# EasyEDA Pro project 平移_立创EDA.epro

# Schematic Schematic1
Board Name: Board1; Create Date: 2025-01-22; Page Name: P1; Project Name: 磁悬浮原理图; Schematic Name: Schematic1; Update Date: 2025-01-25; Company: 嘉立创EDA; Page Size: A4; Version: V1.0
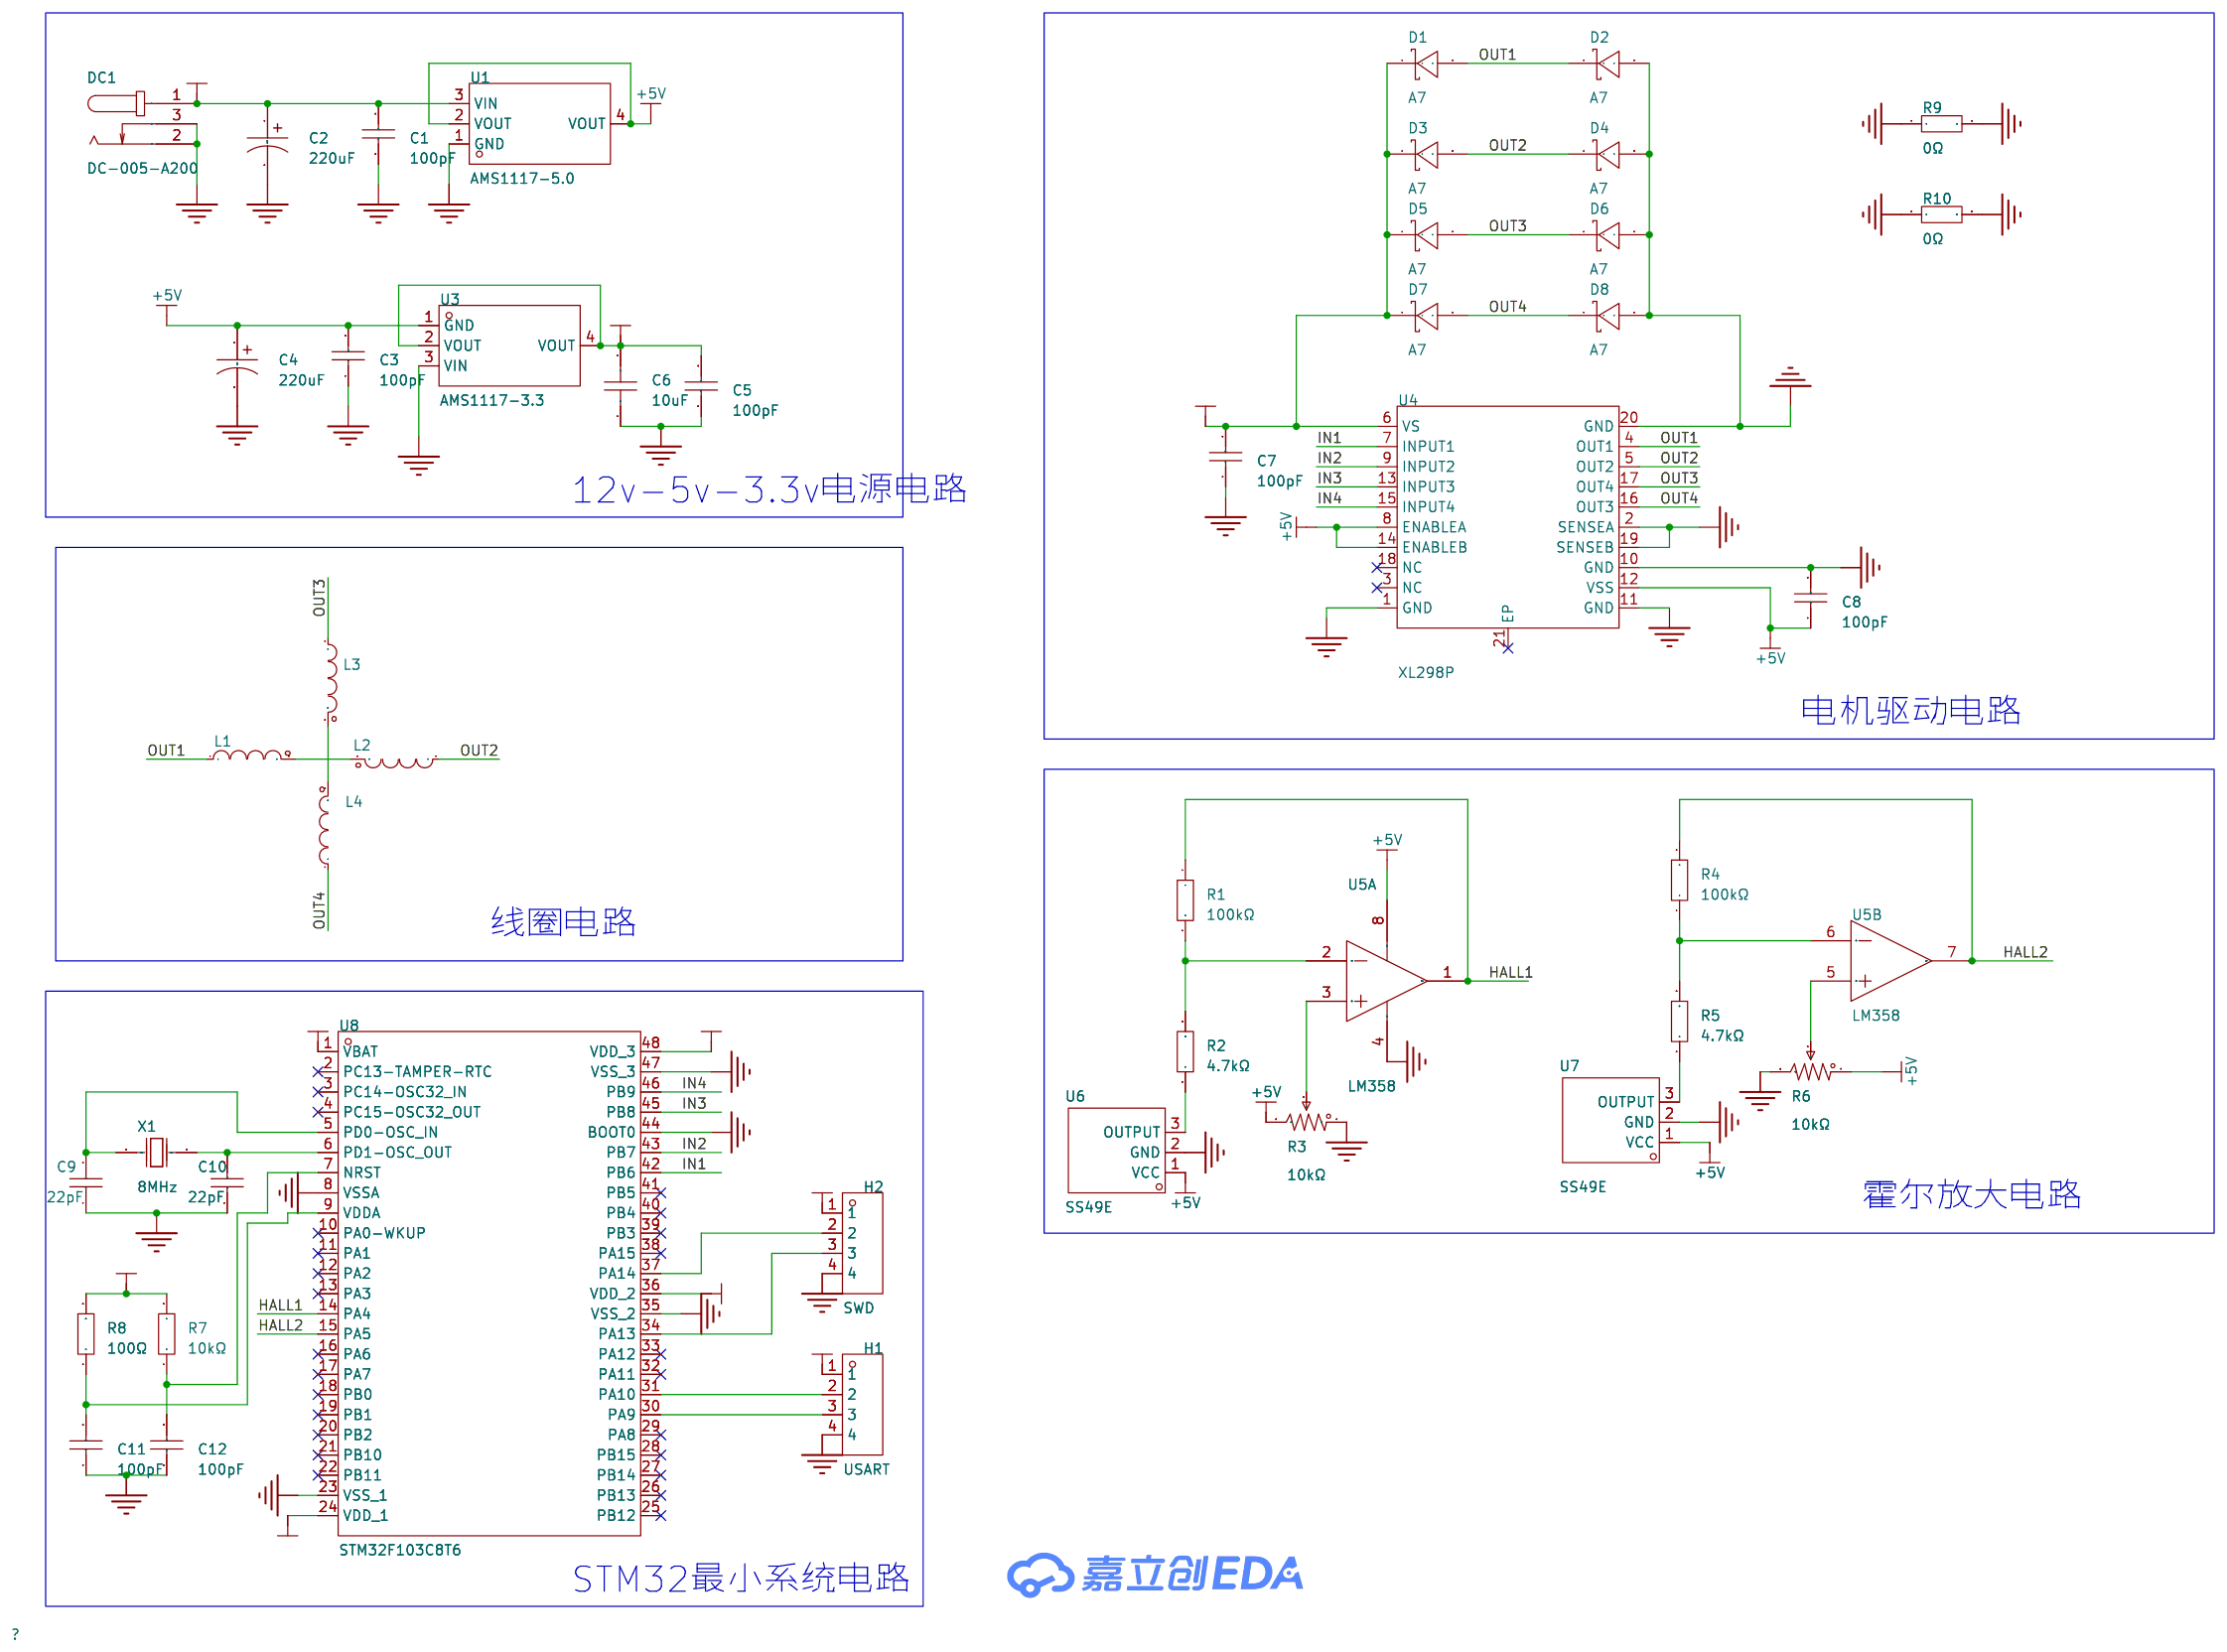
[diagram p0: schematic sheet]

## Parts
C1  100pF  [C0805]
C2  220uF  [CAP-SMD_BD10.0-L10.3-W10.3-LS11.3-FD]
C3  100pF  [C0805]
C4  220uF  [CAP-SMD_BD10.0-L10.3-W10.3-LS11.3-FD]
C5  100pF  [C0805]
C6  10uF  [C0805]
C7  100pF  [C0805]
C8  100pF  [C0805]
C9  22pF  [C0805]
C10  22pF  [C0805]
C11  100pF  [C0805]
C12  100pF  [C0805]
D1  A7  [SOD-123FL_L2.8-W1.8-LS3.7-RD]
D2  A7  [SOD-123FL_L2.8-W1.8-LS3.7-RD]
D3  A7  [SOD-123FL_L2.8-W1.8-LS3.7-RD]
D4  A7  [SOD-123FL_L2.8-W1.8-LS3.7-RD]
D5  A7  [SOD-123FL_L2.8-W1.8-LS3.7-RD]
D6  A7  [SOD-123FL_L2.8-W1.8-LS3.7-RD]
D7  A7  [SOD-123FL_L2.8-W1.8-LS3.7-RD]
D8  A7  [SOD-123FL_L2.8-W1.8-LS3.7-RD]
DC1  DC-005-A200  [DC-IN-TH_DC-005-A200]
H1  USART  [HDR-TH_4P-P2.54-V-M]
H2  SWD  [HDR-TH_4P-P2.54-V-M]
L1  -  [L_INVERTER2_2.1]
L2  -  [L_INVERTER2_2.1]
L3  -  [L_INVERTER2_2.1]
L4  -  [L_INVERTER2_2.1]
R1  100kΩ  [R0805]
R2  4.7kΩ  [R0805]
R3  10kΩ  [RES-ADJ-TH_3P-L10.0-W10.0-P2.50-L]
R4  100kΩ  [R0805]
R5  4.7kΩ  [R0805]
R6  10kΩ  [RES-ADJ-TH_3P-L10.0-W10.0-P2.50-L]
R7  10kΩ  [R0805]
R8  100Ω  [R0805]
R9  0Ω  [R0805]
R10  0Ω  [R0805]
U1  AMS1117-5.0  [SOT-223_L6.5-W3.5-P2.30-LS7.0-BR]
U3  AMS1117-3.3  [SOT-223-3_L6.5-W3.4-P2.30-LS7.0-BR]
U4  XL298P  [HSOP-20_L15.9-W11.0-P1.27-LS14.2-BL-EP]
U5  LM358  [SOP-8_L4.9-W3.9-P1.27-LS6.0-BL]  (sections 1,2)
U6  SS49E  [TO-92S_3P-L4.1-W1.6-P1.27-L]
U7  SS49E  [TO-92S_3P-L4.1-W1.6-P1.27-L]
U8  STM32F103C8T6  [LQFP-48_L7.0-W7.0-P0.50-LS9.0-BL]
X1  8MHz  [CRYSTAL-SMD_L11.5-W4.8-LS12.7]

## Library data of the parts
C1 C3 C5 C7 C8 C11 C12 = CL21C101JBANNNC: 容值:100pF;精度:±5%;额定电压:50V;材质(温度系数):C0G;; LCSC Part Name: 100pF ±5% 50V; Supplier Part: C1790; Manufacturer: SAMSUNG(三星); Supplier Footprint: 0805; JLCPCB Part Class: 基础库; Datasheet: https://atta.szlcsc.com/upload/public/pdf/source/20160218/1457707763339.pdf; Supplier: LCSC; Tolerance: ±5%; Voltage Rated: 50V; Temperature Coefficient: C0G
C2 C4 = HV1H227M1010PZ: 容值:220uF;精度:±20%;额定电压:50V;; LCSC Part Name: 220uF ±20% 50V; Supplier Part: C5246564; Manufacturer: HONOR(荣誉); Supplier Footprint: SMD,D10xL10mm; JLCPCB Part Class: 扩展库; Datasheet: https://atta.szlcsc.com/upload/public/pdf/source/20221103/F889AFCC379E96C645A0A58E4BAC43B0.pdf; Supplier: LCSC; Tolerance: ±20%; Rated Voltage: 50V; φD: 10mm; L: 10mm; Operating Temperature: -55℃~+105℃
C6 = GRM21BR61H106KE43L: 容值:10uF;精度:±10%;额定电压:50V;材质(温度系数):X5R;; LCSC Part Name: 10uF ±10% 50V; Supplier Part: C440198; Manufacturer: muRata(村田); Supplier Footprint: 0805; JLCPCB Part Class: 基础库; Datasheet: https://atta.szlcsc.com/upload/public/pdf/source/20230811/95AAE0C9AF55EDC31B7A4D8B733F534E.pdf; Supplier: LCSC; Tolerance: ±10%; Voltage Rated: 50V; Temperature Coefficient: X5R
C9 C10 = CL21C220JBANNNC: 容值:22pF;精度:±5%;额定电压:50V;材质(温度系数):C0G;; LCSC Part Name: 22pF ±5% 50V; Supplier Part: C1804; Manufacturer: SAMSUNG(三星); Supplier Footprint: 0805; JLCPCB Part Class: 基础库; Datasheet: https://atta.szlcsc.com/upload/public/pdf/source/20160218/1457707763339.pdf; Supplier: LCSC; Tolerance: ±5%; Voltage Rated: 50V; Temperature Coefficient: C0G
D1-D8 = A7_C2891324: 二极管配置:独立式;正向压降(Vf):1.1V@1A;直流反向耐压(Vr):1kV;整流电流:1A;; Supplier Part: C2891324; Manufacturer: GOODWORK(固得沃克); Supplier Footprint: SOD-123FL; JLCPCB Part Class: 扩展库; Datasheet: https://atta.szlcsc.com/upload/public/pdf/source/20240805/B2ACAE0AA1526C78641CB14B0F7BAE8A.pdf; Supplier: LCSC; Diode Configuration: 独立式; Forward Voltage (Vf@If): 1.1V@1A; Reverse Voltage (Vr): 1kV; Rectified Current: 1A; Reverse Leakage Current (Ir): 5uA@1kV
DC1 = DC-005-A200: 连接器类型:DC电源插座;安装方式:弯插;触点内径:2mm;触点外径:6.4mm;额定电流:3A;额定电压:30V;工作温度范围:-20℃~+70℃;; LCSC Part Name: DC电源插座 内径:2mm 外径:6.4mm; Supplier Part: C720557; Manufacturer: XUNPU(讯普); Supplier Footprint: 插件; JLCPCB Part Class: 扩展库; Datasheet: https://atta.szlcsc.com/upload/public/pdf/source/20200812/C720557_2286DFCD6C75B71AF905731F627ABF3A.pdf; Supplier: LCSC; Connector Type: DC电源插座; Mounting Style: 弯插; Inside Contact Diameter: 2mm; Outside Contact Diameter: 6.4mm; Current Rating (Max): 3A; Voltage Rating (Max): 30V; Operating Temperature Range: -20℃~+70℃
H1 H2 = PZ254V-11-04P: 插针结构:1x4P;间距:2.54mm;行距:-;圆针/方针:方针;安装类型:直插;排数:单排;总PIN位数:4P;额定电流:3A;额定电压:250V;配合针长度:6mm;塑高:2.5mm;端接针长度:3mm;触头材质:-;工作温度范围:-40℃~+105℃;颜色:黑色;; LCSC Part Name: 间距:2.54mm 1x4P 直插 方针; Supplier Part: C2691448; Manufacturer: XFCN(兴飞); Supplier Footprint: 插件,P=2.54mm; JLCPCB Part Class: 扩展库; Datasheet: https://atta.szlcsc.com/upload/public/pdf/source/20200309/C492403_F9F19131791D08044AD4F84F8E751A34.pdf; Supplier: LCSC; Pin Structure: 1x4P; Pitch: 2.54mm; Circluar Pins/Square Pins: 方针; Mounting Type: 直插; Number of Rows: 单排; Number of Pins: 4P; Current Rating (Max): 3A; Voltage Rating (Max): 250V; Length of Mating Pin: 6mm; Insulation Height: 2.5mm; Length of End Connection Pin: 3mm; Operating Temperature Range: -40℃~+105℃; Color: 黑色
L1-L4 = L-6Ω-3.54
R1 R4 = 0805W8F1003T5E: 电阻类型:厚膜电阻;阻值:100kΩ;精度:±1%;功率:125mW;最大工作电压:150V;温度系数:±100ppm/℃;; LCSC Part Name: 100kΩ ±1% 125mW 厚膜电阻; Supplier Part: C149504; Manufacturer: UNI-ROYAL(厚声); Supplier Footprint: 0805; JLCPCB Part Class: 基础库; Datasheet: https://atta.szlcsc.com/upload/public/pdf/source/20200306/C422600_1E6D84923E4A46A82E41ADD87F860B5C.pdf; Supplier: LCSC; Type: 厚膜电阻; Tolerance: ±1%; Power(Watts): 125mW; Overload Voltage (Max): 150V; Temperature Coefficient: ±100ppm/℃; Operating Temperature Range: -55℃~+155℃
R2 R5 = 0805W8F4701T5E: 电阻类型:厚膜电阻;阻值:4.7kΩ;精度:±1%;功率:125mW;最大工作电压:150V;温度系数:±100ppm/℃;; LCSC Part Name: 4.7kΩ ±1% 125mW 厚膜电阻; Supplier Part: C17673; Manufacturer: UNI-ROYAL(厚声); Supplier Footprint: 0805; JLCPCB Part Class: 基础库; Datasheet: https://atta.szlcsc.com/upload/public/pdf/source/20200306/C422600_1E6D84923E4A46A82E41ADD87F860B5C.pdf; Supplier: LCSC; Type: 厚膜电阻; Tolerance: ±1%; Power(Watts): 125mW; Overload Voltage (Max): 150V; Temperature Coefficient: ±100ppm/℃; Operating Temperature Range: -55℃~+155℃
R3 R6 = 3296W-1-103: 阻值:10kΩ;精度:±10%;; LCSC Part Name: 10kΩ ±10%; Supplier Part: C118954; Manufacturer: BOCHEN(博晨); Supplier Footprint: 插件; JLCPCB Part Class: 扩展库; Datasheet: https://atta.szlcsc.com/upload/public/pdf/source/20171114/C118954_15106326646611117443.pdf; Supplier: LCSC; Tolerance: ±10%
R7 = 0805W8F1002T5E_C17414: 电阻类型:厚膜电阻;阻值:10kΩ;精度:±1%;功率:125mW;最大工作电压:150V;温度系数:±100ppm/℃;; LCSC Part Name: 10kΩ ±1% 125mW 厚膜电阻; Supplier Part: C17414; Manufacturer: UNI-ROYAL(厚声); Manufacturer Part: 0805W8F1002T5E; Supplier Footprint: 0805; JLCPCB Part Class: 基础库; Datasheet: https://atta.szlcsc.com/upload/public/pdf/source/20200306/C422600_1E6D84923E4A46A82E41ADD87F860B5C.pdf; Supplier: LCSC; Type: 厚膜电阻; Tolerance: ±1%; Power(Watts): 125mW; Overload Voltage (Max): 150V; Temperature Coefficient: ±100ppm/℃; Operating Temperature Range: -55℃~+155℃
R8 = 0805W8F1000T5E: 电阻类型:厚膜电阻;阻值:100Ω;精度:±1%;功率:125mW;最大工作电压:150V;温度系数:±100ppm/℃;; LCSC Part Name: 100Ω ±1% 125mW 厚膜电阻; Supplier Part: C17408; Manufacturer: UNI-ROYAL(厚声); Supplier Footprint: 0805; JLCPCB Part Class: 基础库; Datasheet: https://atta.szlcsc.com/upload/public/pdf/source/20200306/C422600_1E6D84923E4A46A82E41ADD87F860B5C.pdf; Supplier: LCSC; Type: 厚膜电阻; Tolerance: ±1%; Power(Watts): 125mW; Overload Voltage (Max): 150V; Temperature Coefficient: ±100ppm/℃; Operating Temperature Range: -55℃~+155℃
R9 R10 = 0805W8F0000T5E: 电阻类型:厚膜电阻;阻值:0Ω;精度:±1%;功率:125mW;最大工作电压:150V;温度系数:±800ppm/℃;; LCSC Part Name: 0Ω ±1% 125mW 厚膜电阻; Supplier Part: C17477; Manufacturer: UNI-ROYAL(厚声); Supplier Footprint: 0805; JLCPCB Part Class: 基础库; Datasheet: https://atta.szlcsc.com/upload/public/pdf/source/20200306/C422600_1E6D84923E4A46A82E41ADD87F860B5C.pdf; Supplier: LCSC; Type: 厚膜电阻; Tolerance: ±1%; Power(Watts): 125mW; Overload Voltage (Max): 150V; Temperature Coefficient: ±800ppm/℃; Operating Temperature Range: -55℃~+155℃
U1 = AMS1117-5.0_C6187: 输出类型:固定;最大输入电压:12V;输出电压:5V;最大输出电流:1A;电源纹波抑制比(PSRR):68dB@(120Hz);输出极性:正极;; LCSC Part Name: 输入12V 输出5V 1A; Supplier Part: C6187; Manufacturer: AMS; Supplier Footprint: SOT-223; JLCPCB Part Class: 基础库; Datasheet: https://atta.szlcsc.com/upload/public/pdf/source/20230918/E4B716057EE82179D88E8A0894830D59.pdf; Supplier: LCSC; Output Type: 固定; Maximum Input Voltage: 12V; Output Voltage: 5V; MAX Output Current: 1A; Power Supply Rejection Ratio (PSRR): 68dB@(120Hz); Dropout Voltage: 1.3V@(1A); Output Polarity: 正极; Number of Outputs: 1
U3 = AMS1117-3.3_C6186: 输出类型:固定;最大输入电压:-;输出电压:3.3V;最大输出电流:1A;电源纹波抑制比(PSRR):72dB@(120Hz);输出极性:正极;; LCSC Part Name: 输出3.3V 1A; Supplier Part: C6186; Manufacturer: AMS; Supplier Footprint: SOT-223; JLCPCB Part Class: 基础库; Datasheet: https://atta.szlcsc.com/upload/public/pdf/source/20180727/C6186_7A095716F0823C02F1997A905E26C086.pdf; Supplier: LCSC; Output Type: 固定; Output Voltage: 3.3V; MAX Output Current: 1A; Power Supply Rejection Ratio (PSRR): 72dB@(120Hz); Dropout Voltage: 1.3V@(800mA); Output Polarity: 正极; Number of Outputs: 1
U4 = XL298P: Supplier Part: C17179540; Manufacturer: XINLUDA(信路达); Supplier Footprint: HSOP-20; JLCPCB Part Class: 扩展库; Datasheet: https://atta.szlcsc.com/upload/public/pdf/source/20230817/4EF804C328D573B64EB8B0D65C14F3E5.pdf; Supplier: LCSC
U5 = LM358_C5252902: 放大器数:双路;增益带宽积(GBP):1.2MHz;输入偏置电流(Ib):50nA;输入失调电压(Vos):5mV;; LCSC Part Name: 增益带宽(GBP):1.2MHz VIO:5mV  LM358; Supplier Part: C5252902; Manufacturer: MSKSEMI(美森科); Supplier Footprint: SOP-8; JLCPCB Part Class: 扩展库; Datasheet: https://atta.szlcsc.com/upload/public/pdf/source/20221111/EFA130B3B4599AE68A453AC9B85C4BC9.pdf; Supplier: LCSC; Number of Circuits: 双路; Gain Bandwidth Product(GBP): 1.2MHz; Current - Input Bias(Ib): 50nA; Voltage - Input Offset(Vos): 5mV; Common Mode Rejection Ratio (CMRR): 80dB; Supply Voltage: 3V~36V; Output Type: 差分; Supply Current: 300uA; Operating Temperature: 0℃~+70℃
U6 U7 = SS49E: 线性霍尔效应传感器; LCSC Part Name: 霍尔效应传感器; Supplier Part: C85697; Manufacturer: Honeywell(霍尼韦尔); Supplier Footprint: TO-92S; JLCPCB Part Class: 扩展库; Datasheet: https://atta.szlcsc.com/upload/public/pdf/source/20210618/C85697_E65AF15A662ABF64EA11C392420B5C9E.pdf; Supplier: LCSC; supply voltage: 2.7V~6.5V; Operating Temperature: -40℃~+85℃
U8 = STM32F103C8T6: CPU内核:ARM-M3;CPU最大主频:72MHz;应用领域:-;; LCSC Part Name: 主流增强型ARM Cortex-M3 MCU，具有64 KB Flash、72 MHz CPU、电机控制、USB和CAN; Supplier Part: C8734; Manufacturer: ST(意法半导体); Supplier Footprint: LQFP-48(7x7); JLCPCB Part Class: 扩展库; Datasheet: https://atta.szlcsc.com/upload/public/pdf/source/20220812/8363ACEC51AD55ECEB84799464F7CB85.pdf; Supplier: LCSC; CPU Core: ARM-M3; CPU Maximum Speed: 72MHz; Program Storage Size: 64KB; Program Memory Type: FLASH; Number of I/O: 37; ADC (Bit): 12bit; Low Voltage Detection Threshold: 2V~3.6V
X1 = X49SM8MSD2SC: 晶振类型:贴片晶振;频率:8MHz;常温频差:±20ppm;外接负载电容:20pF;频率稳定度(全温):±30ppm;; LCSC Part Name: 8MHz ±20ppm 20pF; Supplier Part: C12674; Manufacturer: YXC(扬兴晶振); Supplier Footprint: HC-49S-SMD; JLCPCB Part Class: 基础库; Datasheet: https://atta.szlcsc.com/upload/public/pdf/source/20240329/3EBF42EBCAB50CA65B6FA9D7CFA1955A.pdf; Supplier: LCSC; Crystal Type: 贴片晶振; Normal temperature Frequency Tolerance: ±20ppm; External load capacitor: 20pF; Frequency Stability(Full temperature range): ±30ppm; Operating Temperature: -20℃~+70℃

## Nets
+3.3V: C5.2 C6.2 H1.1 H2.1 R7.2 R8.2 U3.2(VOUT) U3.4(VOUT) U8.1(VBAT) U8.24(VDD_1) U8.36(VDD_2) U8.48(VDD_3)
+5V: C3.2 C4.1 C8.1 R3.3 R6.1 U1.2(VOUT) U1.4(VOUT) U3.1(GND) U4.8(ENABLEA) U4.12(VSS) U4.14(ENABLEB) U5.8(VCC) U6.1(VCC) U7.1(VCC)
+12V: C1.2 C2.1 C7.2 D1.1(K) D3.1(K) D5.1(K) D7.1(K) DC1.1 U1.3(VIN) U4.6(VS)
AGND: C3.1 C4.2 R3.1 R6.3 R10.1 U1.1(GND) U5.4(VEE) U6.2(GND) U7.2(GND)
GND: C5.1 C6.1 C9.1 C10.1 C11.1 C12.1 H1.4 H2.4 R9.2 R10.2 U3.3(VIN) U8.8(VSSA) U8.23(VSS_1) U8.35(VSS_2) U8.44(BOOT0) U8.47(VSS_3)
PGND: C1.1 C2.2 C7.1 C8.2 D2.2(A) D4.2(A) D6.2(A) D8.2(A) DC1.2 DC1.3 R9.1 U4.1(GND) U4.2(SENSEA) U4.10(GND) U4.11(GND) U4.19(SENSEB) U4.20(GND)
HALL1: R1.1 U5.1(OUT1) U8.14(PA4)
HALL2: R4.2 U5.7(OUT2) U8.15(PA5)
IN1: U4.7(INPUT1) U8.42(PB6)
IN2: U4.9(INPUT2) U8.43(PB7)
IN3: U4.13(INPUT3) U8.45(PB8)
IN4: U4.15(INPUT4) U8.46(PB9)
OUT1: D1.2(A) D2.1(K) L1.1 U4.4(OUT1)
OUT2: D3.2(A) D4.1(K) L2.1 U4.5(OUT2)
OUT3: D5.2(A) D6.1(K) L3.1 U4.17(OUT4)
OUT4: D7.2(A) D8.1(K) L4.1 U4.16(OUT3)
$1N1272: L1.2 L2.2
$1N1276: L3.2 L4.2
$1N2639: R1.2 R2.2 U5.2(IN1-)
$1N2854: R3.2 U5.3(IN1+)
$1N2963: R2.1 U6.3(OUTPUT)
$1N3239: R4.1 R5.2 U5.6(IN2-)
$1N3245: R5.1 U7.3(OUTPUT)
$1N3247: R6.2 U5.5(IN2+)
$1N3876: C10.2 U8.6(PD1-OSC_OUT) X1.1(OSC1)
$1N3912: C9.2 U8.5(PD0-OSC_IN) X1.2(OSC2)
$1N4191: C11.2 R8.1 U8.9(VDDA)
$1N4193: C12.2 R7.1 U8.7(NRST)
Net-(H1-2): H1.2 U8.31(PA10)
Net-(H1-3): H1.3 U8.30(PA9)
Net-(H2-2): H2.2 U8.37(PA14)
Net-(H2-3): H2.3 U8.34(PA13)

Not connected (* = marked no-connect by the designer): U4 3(NC)* 18(NC)* 21(EP)*; U8 2(PC13-TAMPER-RTC)* 3(PC14-OSC32_IN)* 4(PC15-OSC32_OUT)* 10(PA0-WKUP)* 11(PA1)* 12(PA2)* 13(PA3)* 16(PA6)* 17(PA7)* 18(PB0)* 19(PB1)* 20(PB2)* 21(PB10)* 22(PB11)* 25(PB12)* 26(PB13)* 27(PB14)* 28(PB15)* 29(PA8)* 32(PA11)* 33(PA12)* 38(PA15)* 39(PB3)* 40(PB4)* 41(PB5)*

## Notes on the sheet
- 12v-5v-3.3v电源电路
- 电机驱动电路
- 线圈电路
- 霍尔放大电路
- STM32最小系统电路

# Board PCB1
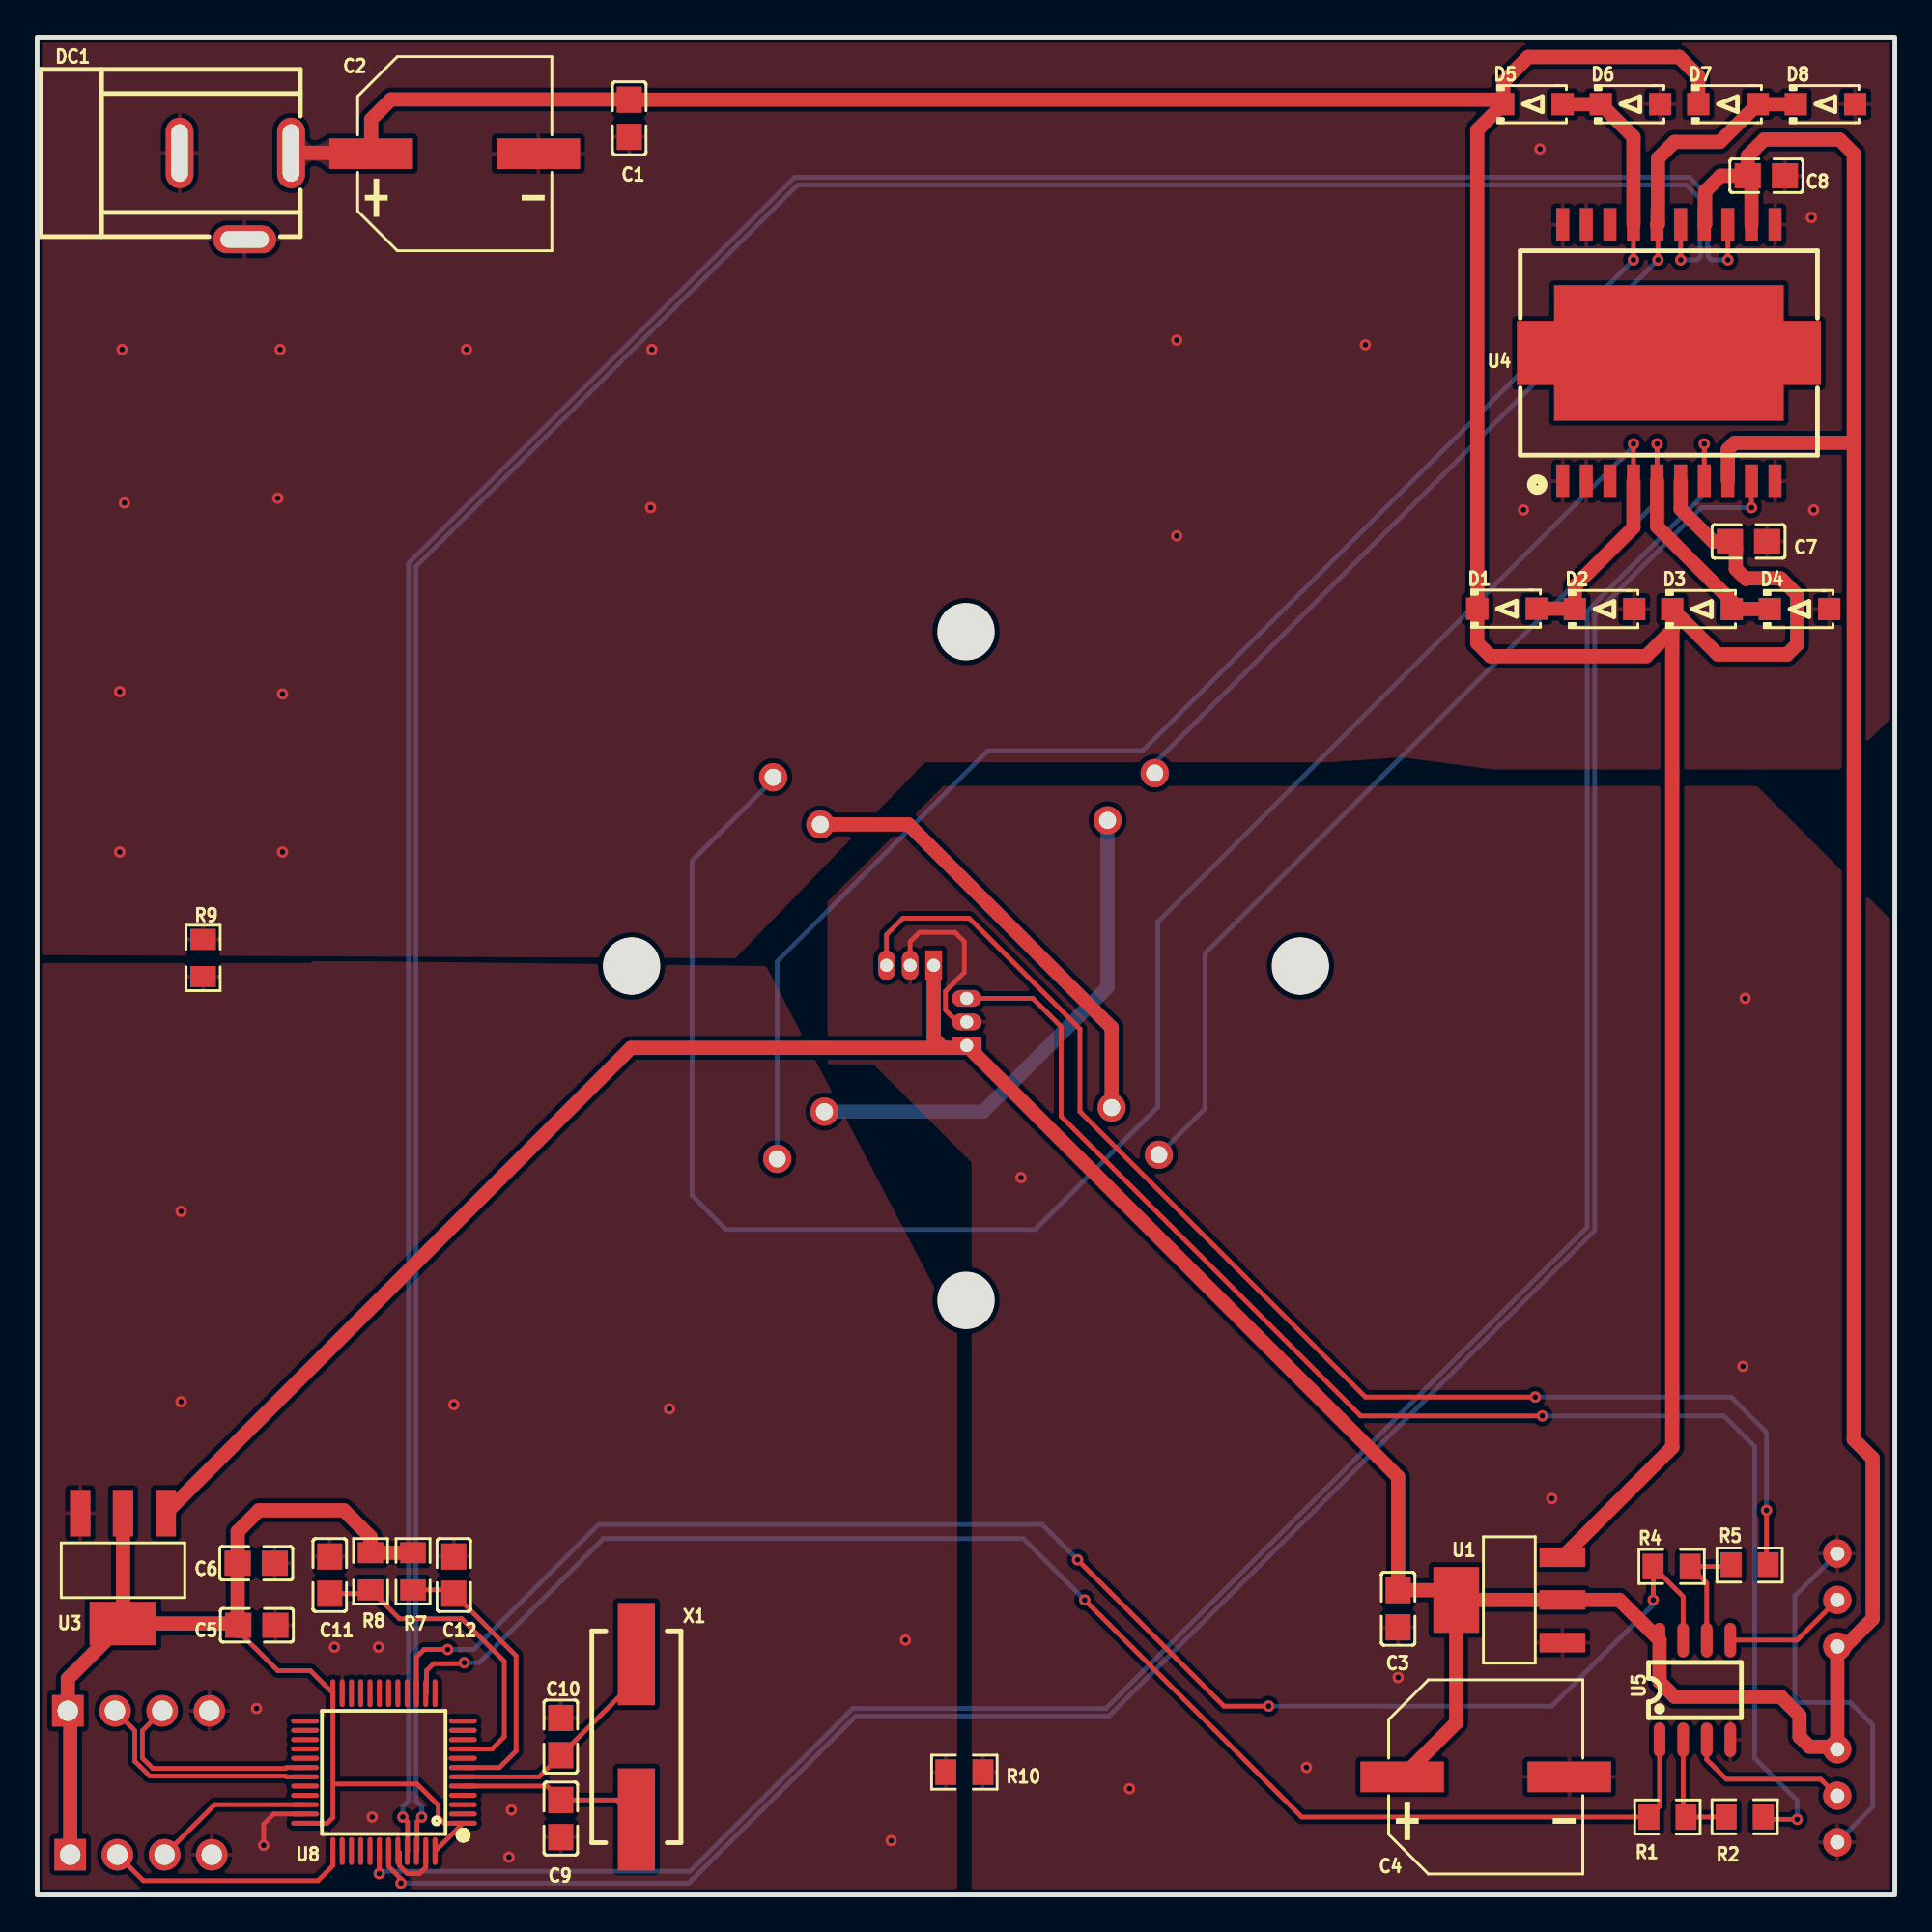
[diagram p1: board, top side]
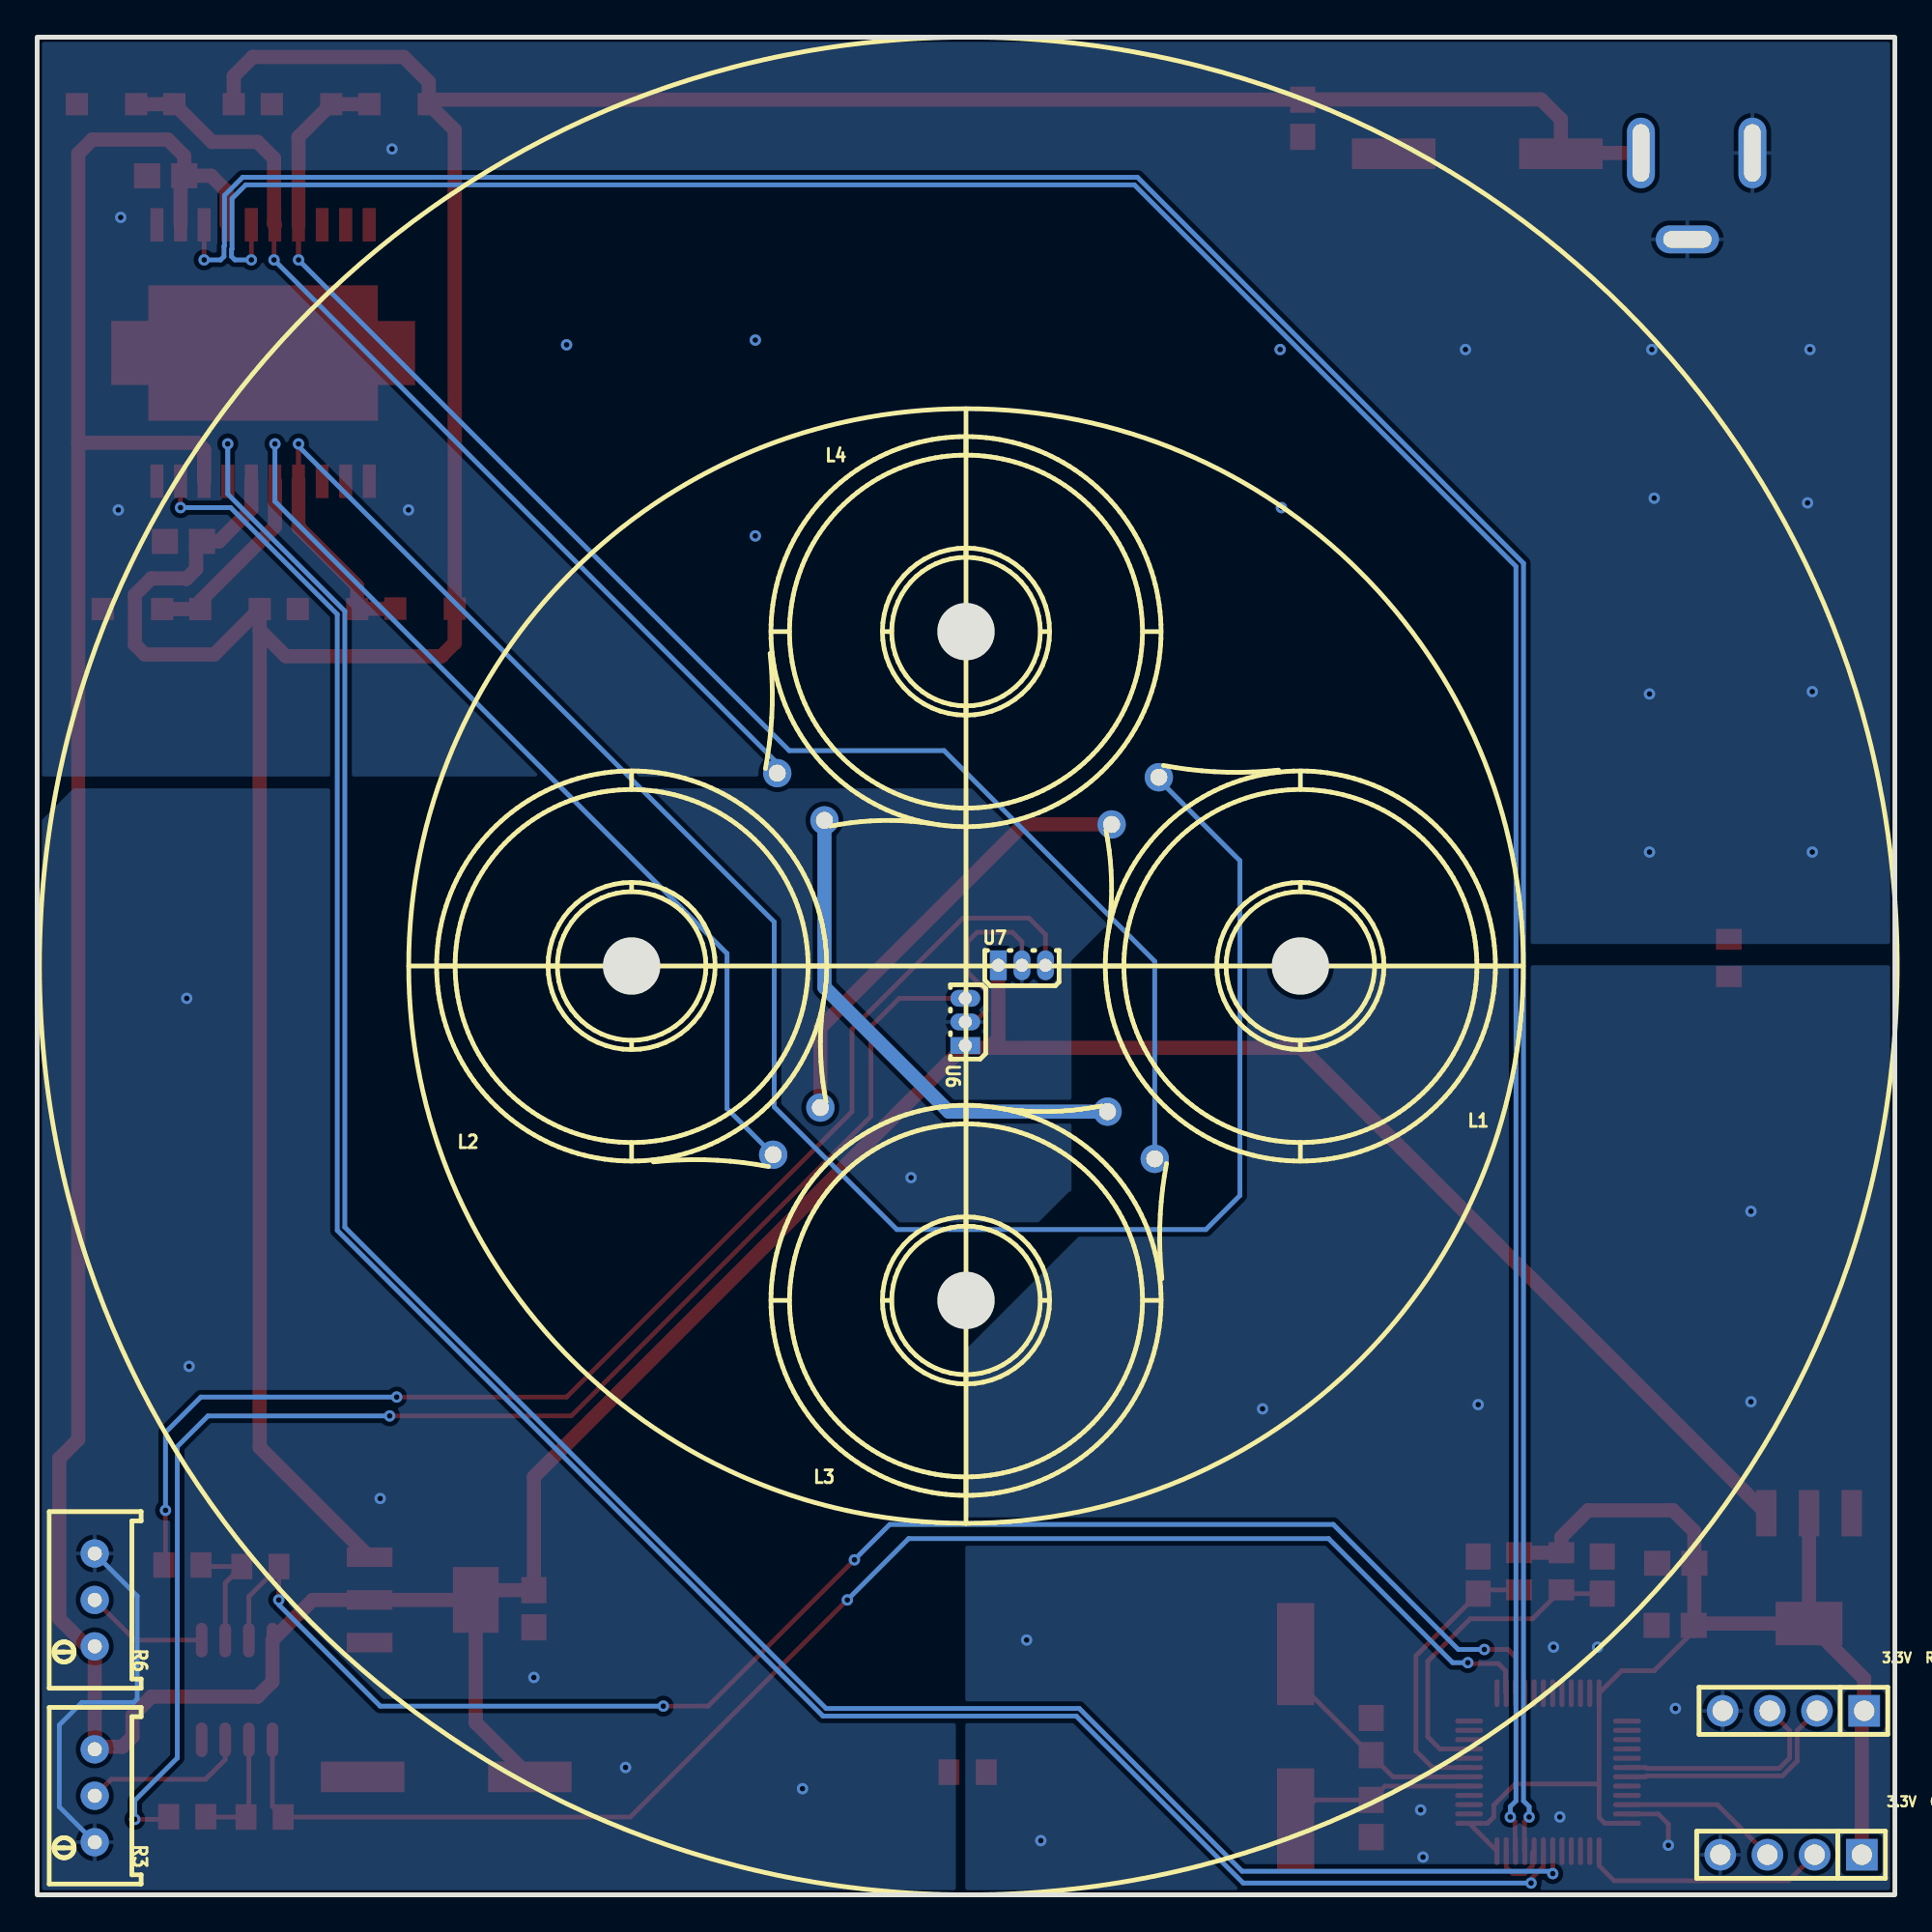
[diagram p2: board, bottom side, seen from below]

Outline 100 x 100 mm; copper layers: Top Layer, Bottom Layer. Coordinates in mm from the lower left corner of the outline.
Outline path: rectangle 0,0 100,100
Stack: Top Layer 0.035mm / Dielectric1 1.51mm FR4 er 4.5 / Bottom Layer 0.035mm

## Design rules (mm)
net $1N4555: DP1
net $1N4551: DP1
net IN1: DP2
net IN2: DP2
net IN3: DP3
net IN4: DP3
template: JLCPCB Capability(Two Layers Board)
spacing copperThickness1oz (default): track to track 0.102, other pairs 0.152 to 0.3
spacing copperThickness2oz: track to track 0.203, other pairs 0.152 to 0.3
track width copperThickness1oz (default): min 0.127, default 0.254, max 2.54
track width copperThickness2oz: min 0.203, default 0.254, max 2.54
differential pair differentialPair (default): width min 0.127, default 0.254, max 2.54; gap min 0.152, default 0.152
via viaSize (default): diameter min 0.5, default 0.61, max 10; hole min 0.3, default 0.305, max 6.3

## Placement (name value [footprint] x y rotation side)
3.3V  CLK  DIO  GND  -  [HDR-TH_4P-P2.54-V-M]  5.59 2.16 0 bottom
3.3V  RX  TX  GND  -  [HDR-TH_4P-P2.54-V-M]  5.46 9.91 0 bottom
C1  100pF  [C0805]  31.88 95.64 90 top
C2  220uF  [CAP-SMD_BD10.0-L10.3-W10.3-LS11.3-FD]  22.48 93.73 0 top
C3  100pF  [C0805]  73.26 15.4 90 top
C4  220uF  [CAP-SMD_BD10.0-L10.3-W10.3-LS11.3-FD]  77.98 6.35 0 top
C5  100pF  [C0805]  11.83 14.51 180 top
C6  10uF  [C0805]  11.79 17.85 180 top
C7  100pF  [C0805]  92.12 72.86 180 top
C8  100pF  [C0805]  93.08 92.54 0 top
C9  22pF  [C0805]  28.19 4.11 90 top
C10  22pF  [C0805]  28.19 8.52 270 top
C11  100pF  [C0805]  15.75 17.21 270 top
C12  100pF  [C0805]  22.43 17.21 270 top
D1  A7  [SOD-123FL_L2.8-W1.8-LS3.7-RD]  79.12 69.23 0 top
D2  A7  [SOD-123FL_L2.8-W1.8-LS3.7-RD]  84.37 69.22 0 top
D3  A7  [SOD-123FL_L2.8-W1.8-LS3.7-RD]  89.62 69.22 0 top
D4  A7  [SOD-123FL_L2.8-W1.8-LS3.7-RD]  94.87 69.22 0 top
D5  A7  [SOD-123FL_L2.8-W1.8-LS3.7-RD]  80.52 96.39 0 top
D6  A7  [SOD-123FL_L2.8-W1.8-LS3.7-RD]  85.77 96.39 0 top
D7  A7  [SOD-123FL_L2.8-W1.8-LS3.7-RD]  91.02 96.39 0 top
D8  A7  [SOD-123FL_L2.8-W1.8-LS3.7-RD]  96.27 96.39 0 top
DC1  DC-005-A200  [DC-IN-TH_DC-005-A200]  10.67 91.44 0 top
L1  -  [L_INVERTER2_2.1]  32 50 0 bottom
L2  -  [L_INVERTER2_2.1]  68 50 180 bottom
L3  -  [L_INVERTER2_2.1]  50 32 90 bottom
L4  -  [L_INVERTER2_2.1]  50 68 270 bottom
R1  100kΩ  [R0805]  87.76 4.19 0 top
R2  4.7kΩ  [R0805]  91.92 4.2 180 top
R3  10kΩ  [RES-ADJ-TH_3P-L10.0-W10.0-P2.50-L]  96.9 5.33 90 bottom
R4  100kΩ  [R0805]  87.98 17.67 180 top
R5  4.7kΩ  [R0805]  92.18 17.75 180 top
R6  10kΩ  [RES-ADJ-TH_3P-L10.0-W10.0-P2.50-L]  96.9 15.88 90 bottom
R7  10kΩ  [R0805]  20.23 17.42 90 top
R8  100Ω  [R0805]  17.95 17.42 90 top
R9  0Ω  [R0805]  8.93 50.43 270 top
R10  0Ω  [R0805]  49.91 6.6 180 top
U1  AMS1117-5.0  [SOT-223_L6.5-W3.5-P2.30-LS7.0-BR]  79.25 15.88 0 top
U3  AMS1117-3.3  [SOT-223-3_L6.5-W3.4-P2.30-LS7.0-BR]  4.62 17.57 90 top
U4  XL298P  [HSOP-20_L15.9-W11.0-P1.27-LS14.2-BL-EP]  87.84 83 0 top
U5  LM358  [SOP-8_L4.9-W3.9-P1.27-LS6.0-BL]  89.24 11.03 0 top
U6  SS49E  [TO-92S_3P-L4.1-W1.6-P1.27-L]  50.04 46.99 90 bottom
U7  SS49E  [TO-92S_3P-L4.1-W1.6-P1.27-L]  46.99 50.04 180 bottom
U8  STM32F103C8T6  [LQFP-48_L7.0-W7.0-P0.50-LS9.0-BL]  18.67 6.6 90 top
X1  8MHz  [CRYSTAL-SMD_L11.5-W4.8-LS12.7]  32.26 8.51 270 top

## Footprints (pads in the part's own frame, mm; a bottom-side part is the same pattern mirrored in y, then rotated)
C0805
  rect 1.41x1.35 smd: 1(-1,0) 2(1,0)
CAP-SMD_BD10.0-L10.3-W10.3-LS11.3-FD
  rect 4.5x1.65 smd: 1(-4.5,0) 2(4.5,0)
CRYSTAL-SMD_L11.5-W4.8-LS12.7
  rect 5.5x2 smd: 1(-4.45,0) 2(4.45,0)
DC-IN-TH_DC-005-A200
  oval 1.5x3.8 hole 0.9x3.1: 1(3,2.325) 2(-3,2.325)
  oval 3.4x1.5 hole 2.6x0.9: 3(0.5,-2.325)
HDR-TH_4P-P2.54-V-M
  rect 1.7x1.7 hole 1.1: 1(-3.81,0)
  round 1.7 hole 1.1: 2(-1.27,0) 3(1.27,0) 4(3.81,0)
HSOP-20_L15.9-W11.0-P1.27-LS14.2-BL-EP
  rect 0.7x1.8 smd: 1(-5.715,-6.9) 2(-4.445,-6.9) 3(-3.175,-6.9) 4(-1.905,-6.9) 5(-0.635,-6.9) 6(0.635,-6.9) 7(1.905,-6.9) 8(3.175,-6.9) 9(4.447,-6.9) 10(5.715,-6.9) 11(5.715,6.9) 12(4.445,6.9) 13(3.175,6.9) 14(1.905,6.9) 15(0.635,6.9) 16(-0.635,6.9) 17(-1.905,6.9) 18(-3.175,6.9) 19(-4.445,6.9) 20(-5.715,6.9)
  custom 16.356x7.298 smd: 21(0.001,0)
L_INVERTER2_2.1
  round 1.524 hole 0.914: 1(7.62,-10.16) 2(10.16,-7.62)
LQFP-48_L7.0-W7.0-P0.50-LS9.0-BL
  oval 0.27x1.5 smd: 1(-2.75,-4.25) 2(-2.25,-4.25) 3(-1.75,-4.25) 4(-1.25,-4.25) 5(-0.75,-4.25) 6(-0.25,-4.25) 7(0.25,-4.25) 8(0.75,-4.25) 9(1.25,-4.25) 10(1.75,-4.25) 11(2.25,-4.25) 12(2.75,-4.25) 25(2.75,4.25) 26(2.25,4.25) 27(1.75,4.25) 28(1.25,4.25) 29(0.75,4.25) 30(0.25,4.25) 31(-0.25,4.25) 32(-0.75,4.25) 33(-1.25,4.25) 34(-1.75,4.25) 35(-2.25,4.25) 36(-2.75,4.25)
  oval 1.5x0.27 smd: 13(4.25,-2.75) 14(4.25,-2.25) 15(4.25,-1.75) 16(4.25,-1.25) 17(4.25,-0.75) 18(4.25,-0.25) 19(4.25,0.25) 20(4.25,0.75) 21(4.25,1.25) 22(4.25,1.75) 23(4.25,2.25) 24(4.25,2.75) 37(-4.25,2.75) 38(-4.25,2.25) 39(-4.25,1.75) 40(-4.25,1.25) 41(-4.25,0.75) 42(-4.25,0.25) 43(-4.25,-0.25) 44(-4.25,-0.75) 45(-4.25,-1.25) 46(-4.25,-1.75) 47(-4.25,-2.25) 48(-4.25,-2.75)
R0805
  rect 1.133x1.377 smd: 1(-1,0) 2(1,0)
RES-ADJ-TH_3P-L10.0-W10.0-P2.50-L
  round 1.524 hole 0.762: 1(-2.5,0) 2(0,0) 3(2.5,0)
SOD-123FL_L2.8-W1.8-LS3.7-RD
  rect 1.2x1.2 smd: 1(-1.6,0) 2(1.6,0)
SOP-8_L4.9-W3.9-P1.27-LS6.0-BL
  oval 0.63x1.865 smd: 1(-1.905,-2.683) 2(-0.635,-2.683) 3(0.635,-2.683) 4(1.905,-2.683) 5(1.905,2.683) 6(0.635,2.683) 7(-0.635,2.683) 8(-1.905,2.683)
SOT-223-3_L6.5-W3.4-P2.30-LS7.0-BR
  rect 2.5x1.1 smd: 1(2.97,-2.3) 2(2.97,0) 3(2.97,2.3)
  rect 2.34x3.6 smd: 4(-2.97,0)
SOT-223_L6.5-W3.5-P2.30-LS7.0-BR
  rect 2.465x1.05 smd: 1(2.857,-2.3) 2(2.857,0) 3(2.857,2.3)
  rect 2.465x3.54 smd: 4(-2.857,0)
TO-92S_3P-L4.1-W1.6-P1.27-L
  rect 0.9x1.6 hole 0.7: 1(-1.27,0)
  oval 0.9x1.6 hole 0.7: 2(0,0) 3(1.27,0)

## Nets
As in the schematic, except:
+3.3V: 3.3V  CLK  DIO  GND.1 3.3V  RX  TX  GND.1 C5.2 C6.2 R7.2 R8.2 U3.2 U3.4 U8.1 U8.24 U8.36 U8.48
GND: 3.3V  CLK  DIO  GND.4 3.3V  RX  TX  GND.4 C5.1 C6.1 C9.1 C10.1 C11.1 C12.1 R9.2 R10.2 U3.3 U8.8 U8.23 U8.35 U8.44 U8.47
$1N4551: 3.3V  RX  TX  GND.3 U8.30
$1N4555: 3.3V  RX  TX  GND.2 U8.31
$1N4656: 3.3V  CLK  DIO  GND.2 U8.37
$1N4663: 3.3V  CLK  DIO  GND.3 U8.34

Pads without a net: U4 3 18 21; U8 2 3 4 10 11 12 13 16 17 18 19 20 21 22 25 26 27 28 29 32 33 38 39 40 41

## Via types
v1: diameter 0.61, hole 0.305, Top Layer to Bottom Layer, 60 vias

## Routing (per net, layer and track width the routed paths; a pad name or vN(x,y) marks a point on that pad's centre or on a via; arc(x,y) is an arc through that point)
+3.3V: length 67.6
  Top Layer w0.254: U8.36 15.62,3.85 15.92,4.16 15.92,5.92 ; U8.48 U8.1 21.93,3.85 21.59,4.19 21.59,4.83 20.45,5.97 15.97,5.97 15.92,5.92 ; 15.92,5.92 U8.24 14.71,12.06 12.95,12.06 10.83,14.19
  Top Layer w0.762: R7.2 R8.2 17.95,19.26 16.51,20.7 11.94,20.7 10.79,19.56 C6.2 10.79,14.67 10.73,14.6 U3.4 ; U3.4 U3.2 ; U3.4 1.65,11.63 3.3V  RX  TX  GND.1 1.78,9.78 3.3V  CLK  DIO  GND.1 ; 10.83,14.19 C5.2
+5V: length 247.7
  Top Layer w0.762: C8.1 92.08,93.61 92.96,94.49 97.03,94.49 97.79,93.73 97.79,78.16 ; C8.1 92.28,92.34 U4.12 ; C8.1 90.63,92.54 89.79,91.69 89.79,89.95 U4.14 ; 97.79,78.16 91.37,78.16 91.01,77.8 91.01,76.1 ; 97.79,78.16 97.79,24.51 98.81,23.5 98.81,14.86 97.32,13.38 R6.1 R3.3 96.76,7.97 95.41,7.97 94.87,8.51 94.87,9.65 93.85,10.67 88.14,10.67 87.33,11.47 U5.8 85.17,15.88 U1.2 U1.4 ; U1.4 75.86,16.4 C3.2 73.26,22.5 U6.1 49.91,45.59 48.77,45.59 ; U1.4 76.39,9.26 C4.1 ; 48.77,45.59 31.97,45.59 U3.1 ; 48.77,45.59 48.26,46.1 U7.1
+12V: length 197.3
  Top Layer w0.762: D5.1 78.68,96.63 C1.2 31.86,96.65 19.05,96.65 17.98,95.58 C2.1 17.94,93.77 DC1.1 ; D5.1 77.52,95 77.52,67.39 78.23,66.67 86.61,66.67 88.02,68.08 ; D5.1 78.92,97.59 80.26,98.93 88.39,98.93 89.42,97.91 D7.1 ; 88.02,68.08 D3.1 90.46,66.77 94.2,66.77 94.74,67.31 94.74,69.98 93.85,70.87 92.01,70.87 91.98,70.83 91.44,71.37 91.44,72.54 C7.2 90.21,72.86 88.47,74.6 88.47,76.1 ; 88.02,68.08 88.02,24.09 U1.3
AGND: length 30.8
  Top Layer w0.254: U6.2 49.53,46.99 48.9,47.62 48.9,48.64 49.91,49.66 49.91,51.31 49.4,51.82 47.5,51.82 46.99,51.31 U7.2
  Bottom Layer w0.254: R3.1 98.81,4.74 98.81,9.14 97.59,10.36 94.79,10.36 94.62,10.54 94.62,16.09 R6.3
  vias: v1(52.96,38.61) v1(58.8,5.72) v1(68.33,6.86) v1(73.26,11.7) v1(81.53,21.34) v1(91.82,28.45) v1(91.95,48.26)
GND: length 7
  Top Layer w0.254: U8.47 20.92,1.49 20.57,1.14 19.93,1.14 19.5,1.57 19.5,2.27 U8.44 ; v1(12.19,2.67) 12.19,3.81 12.74,4.35 U8.35
  vias: v1(7.75,36.8) v1(7.75,26.54) v1(11.81,10.03) v1(16,13.34) v1(18.03,4.19) v1(18.37,13.34) v1(22.43,26.39) v1(25.4,2.03) v1(25.53,4.57) v1(34.04,26.16) v1(45.97,2.92) v1(46.74,13.72)
PGND:
  vias: v1(4.44,64.77) v1(4.44,56.13) v1(4.57,83.19) v1(4.7,74.93) v1(12.95,75.18) v1(13.08,83.19) v1(13.21,64.64) v1(13.21,56.13) v1(23.11,83.19) v1(33.02,74.68) v1(33.09,83.19) v1(61.34,83.69) v1(61.34,73.15) v1(71.5,83.44) v1(80.01,74.55) v1(80.9,93.98) v1(95.5,90.3) v1(95.63,74.55)
HALL1: length 80.6
  Top Layer w0.254: U5.1 87.33,4.77 R1.1 68.07,4.19 v1(56.39,15.88) ; U8.14 20.95,10.89 20.95,12.06 21.34,12.45 22.93,12.45 v1(22.99,12.5)
  Bottom Layer w0.254: v1(22.99,12.5) 23.8,12.5 30.48,19.18 53.09,19.18 v1(56.39,15.88)
HALL2: length 84.5
  Top Layer w0.254: v1(87,15.88) 87,17.66 ; 87,17.66 R4.2 ; 87,17.66 88.6,16.05 U5.7 ; v1(66.29,10.16) 63.88,10.16 v1(56.01,18.03) ; U8.15 20.42,12.8 20.83,13.21 v1(22.1,13.21)
  Bottom Layer w0.254: v1(22.1,13.21) 23.5,13.21 30.23,19.94 54.1,19.94 v1(56.01,18.03) ; v1(87,15.88) 87,15.62 81.53,10.16 v1(66.29,10.16)
IN1: length 127.4
  Top Layer w0.254: U8.42 18.42,2.35 v1(18.42,1.14) ; 89.74,76.1 v1(89.74,78.11)
  Bottom Layer w0.254: v1(89.74,78.11) 89.74,75.41 83.44,69.11 83.44,35.94 57.53,10.03 43.9,10.03 35.14,1.27 18.54,1.27 v1(18.42,1.14)
IN2: length 126.2
  Top Layer w0.254: U8.43 18.92,1.53 19.58,0.86 v1(19.58,0.63) ; 92.28,76.1 v1(92.28,74.68)
  Bottom Layer w0.254: v1(92.28,74.68) 89.58,74.68 83.85,68.94 83.85,35.77 57.7,9.63 44.07,9.63 35.08,0.63 v1(19.58,0.63)
IN3: length 154.8
  Top Layer w0.254: v1(19.69,4.19) 19.94,3.94 19.94,2.37 U8.45 ; U4.13 v1(91.01,88.01)
  Bottom Layer w0.254: v1(91.01,88.01) 90.12,88.01 89.94,88.19 89.94,88.75 89.92,88.77 89.92,91.48 88.94,92.46 40.77,92.46 19.99,71.68 19.99,5.06 19.69,4.75 v1(19.69,4.19)
IN4: length 153.5
  Top Layer w0.254: v1(20.7,4.19) 20.45,3.94 20.45,2.38 U8.46 ; U4.15 v1(88.47,88.01)
  Bottom Layer w0.254: v1(88.47,88.01) 89.36,88.01 89.54,88.19 89.54,88.58 89.51,88.6 89.51,91.31 88.77,92.05 40.94,92.05 20.4,71.51 20.4,5.06 20.7,4.75 v1(20.7,4.19)
OUT1: length 111.4
  Top Layer w0.254: 85.93,76.1 v1(85.93,78.11)
  Top Layer w0.762: 85.93,76.1 85.93,73.61 82.77,70.45 D2.1 82.75,69.23 D1.2
  Bottom Layer w0.254: L1.1 39.62,60.03 35.25,55.67 35.25,37.64 37.08,35.81 53.72,35.81 60.32,42.42 60.32,52.37 85.93,77.98 v1(85.93,78.11)
OUT2: length 62
  Top Layer w0.254: 87.2,76.1 v1(87.2,78.11)
  Top Layer w0.762: 87.2,76.1 87.2,73.66 91.22,69.64 D3.2 D4.1
  Bottom Layer w0.254: L2.1 62.87,42.33 62.87,50.67 87.2,75.01 v1(87.2,78.11)
OUT3: length 83.5
  Top Layer w0.254: U4.17 v1(85.93,88.01)
  Top Layer w0.762: D5.2 D6.1 85.93,94.63 U4.17
  Bottom Layer w0.254: v1(85.93,88.01) 59.51,61.59 51.18,61.59 39.84,50.25 L3.1
OUT4: length 53
  Top Layer w0.254: v1(87.25,88.01) 87.25,89.85 U4.16
  Top Layer w0.762: D8.1 D7.2 90.58,94.36 88.14,94.36 87.25,93.47 87.25,89.95 U4.16
  Bottom Layer w0.254: L4.1 60.16,60.92 v1(87.25,88.01)
$1N1272: length 24.5
  Top Layer w0.762: L1.2 46.9,57.62 57.84,46.68 L2.2
$1N1276: length 27
  Bottom Layer w0.762: L4.2 57.62,48.86 50.92,42.16 L3.2
$1N2639: length 6.4
  Top Layer w0.254: U5.2 88.6,4.34 R1.2 90.91,4.19 R2.2
$1N2854: length 8.9
  Top Layer w0.254: R3.2 96.01,6.22 90.93,6.22 89.87,7.28 U5.3
$1N2963: length 78.1
  Top Layer w0.254: U6.3 53.59,48.26 55.12,46.74 55.12,41.91 71.25,25.78 v1(81.03,25.78) ; R2.1 93.06,4.06 v1(94.74,4.06)
  Bottom Layer w0.254: v1(81.03,25.78) 90.81,25.78 92.46,24.13 92.46,7.37 94.74,5.08 v1(94.74,4.06)
$1N3239: length 6.6
  Top Layer w0.254: R5.2 91.1,17.67 R4.1 89.87,16.78 U5.6
$1N3245: length 70.6
  Top Layer w0.254: R5.1 93.09,17.84 v1(93.09,20.7) ; U7.3 45.72,51.69 46.61,52.58 50.16,52.58 56.13,46.61 56.13,42.16 71.5,26.8 v1(80.65,26.8)
  Bottom Layer w0.254: v1(80.65,26.8) 91.19,26.8 93.09,24.89 v1(93.09,20.7)
$1N3247: length 6.7
  Top Layer w0.254: U5.5 94.74,13.71 R6.2
$1N3876: length 12.9
  Top Layer w0.254: U8.6 27.02,6.35 C10.2 32.26,11.59 32.26,12.96
$1N3912: length 10.1
  Top Layer w0.254: X1.2 31.21,5.11 C9.2 27.44,5.85 U8.5
$1N4191: length 17.6
  Top Layer w0.254: C11.2 17.74,16.21 R8.1 19.5,14.86 22.86,14.86 25.15,12.57 25.15,8.51 24.49,7.85 U8.9
$1N4193: length 15.4
  Top Layer w0.254: R7.1 22.23,16.42 C12.2 25.78,12.86 25.78,7.75 24.89,6.85 U8.7
$1N4551: length 12
  Top Layer w0.254: 3.3V  RX  TX  GND.3 5.66,8.84 5.66,7.37 6.22,6.81 13.37,6.81 13.42,6.85 U8.30
$1N4555: length 12.7
  Top Layer w0.254: 3.3V  RX  TX  GND.2 5.26,8.84 5.26,7.2 6.05,6.4 13.37,6.4 13.42,6.35 U8.31
$1N4656: length 13.3
  Top Layer w0.254: 3.3V  CLK  DIO  GND.2 5.72,0.76 15.11,0.76 15.92,1.57 U8.37
$1N4663: length 8.7
  Top Layer w0.254: 3.3V  CLK  DIO  GND.3 9.55,4.85 U8.34

## Copper pours and planes (outline as drawn; the poured copper is in the pictures)
AGND on Top Layer: 48.77,59.69 92.58,59.69 105.54,46.74 105.54,-4.32 100.46,-9.4 58.93,-9.4 50.29,-0.76 50.29,39.43 45.02,44.7 42.54,44.7 42.54,53.47
AGND on Bottom Layer: 39.62,52.07 47.12,59.56 98.04,59.56 100.58,57.02 100.58,-1.52 50.55,-1.52 50.55,31.75 44.45,37.85 44.32,37.85 44.32,50.29 42.54,52.07
GND on Top Layer: 0.38,50.17 14.73,50.17 14.86,50.29 39.24,50 49.53,30.35 49.53,-0.76 49.66,-0.89 -1.65,-0.89 -2.16,-1.4 -2.16,47.62
GND on Bottom Layer: -0.89,50.04 38.8,50.04 39.07,49.77 42.15,49.77 42.54,50.17 42.54,43.18 42.8,42.93 42.8,36.58 50.04,29.34 50.04,-1.14 -0.89,-1.14 -1.78,-0.25 -1.78,49.15
PGND on Top Layer: -2.03,100.84 102.36,100.84 103.25,101.73 103.25,66.8 97.03,60.58 78.42,60.58 73.43,61.24 69.47,60.96 47.79,60.96 37.59,50.42 -2.39,50.6 -3.3,99.57
PGND on Bottom Layer: -2.16,102.36 102.24,102.36 103.25,101.35 103.25,62.23 101.22,60.2 47.88,60.2 46.86,61.21 37.97,52.32 37.97,51.18 -2.79,51.18 -3.3,50.67 -3.3,101.22

Small or netless copper shapes (teardrops, artwork), in the pictures only: 2 on Top Layer
